# EAGLE design au6850_mp3 (EAGLE 7.6.0)
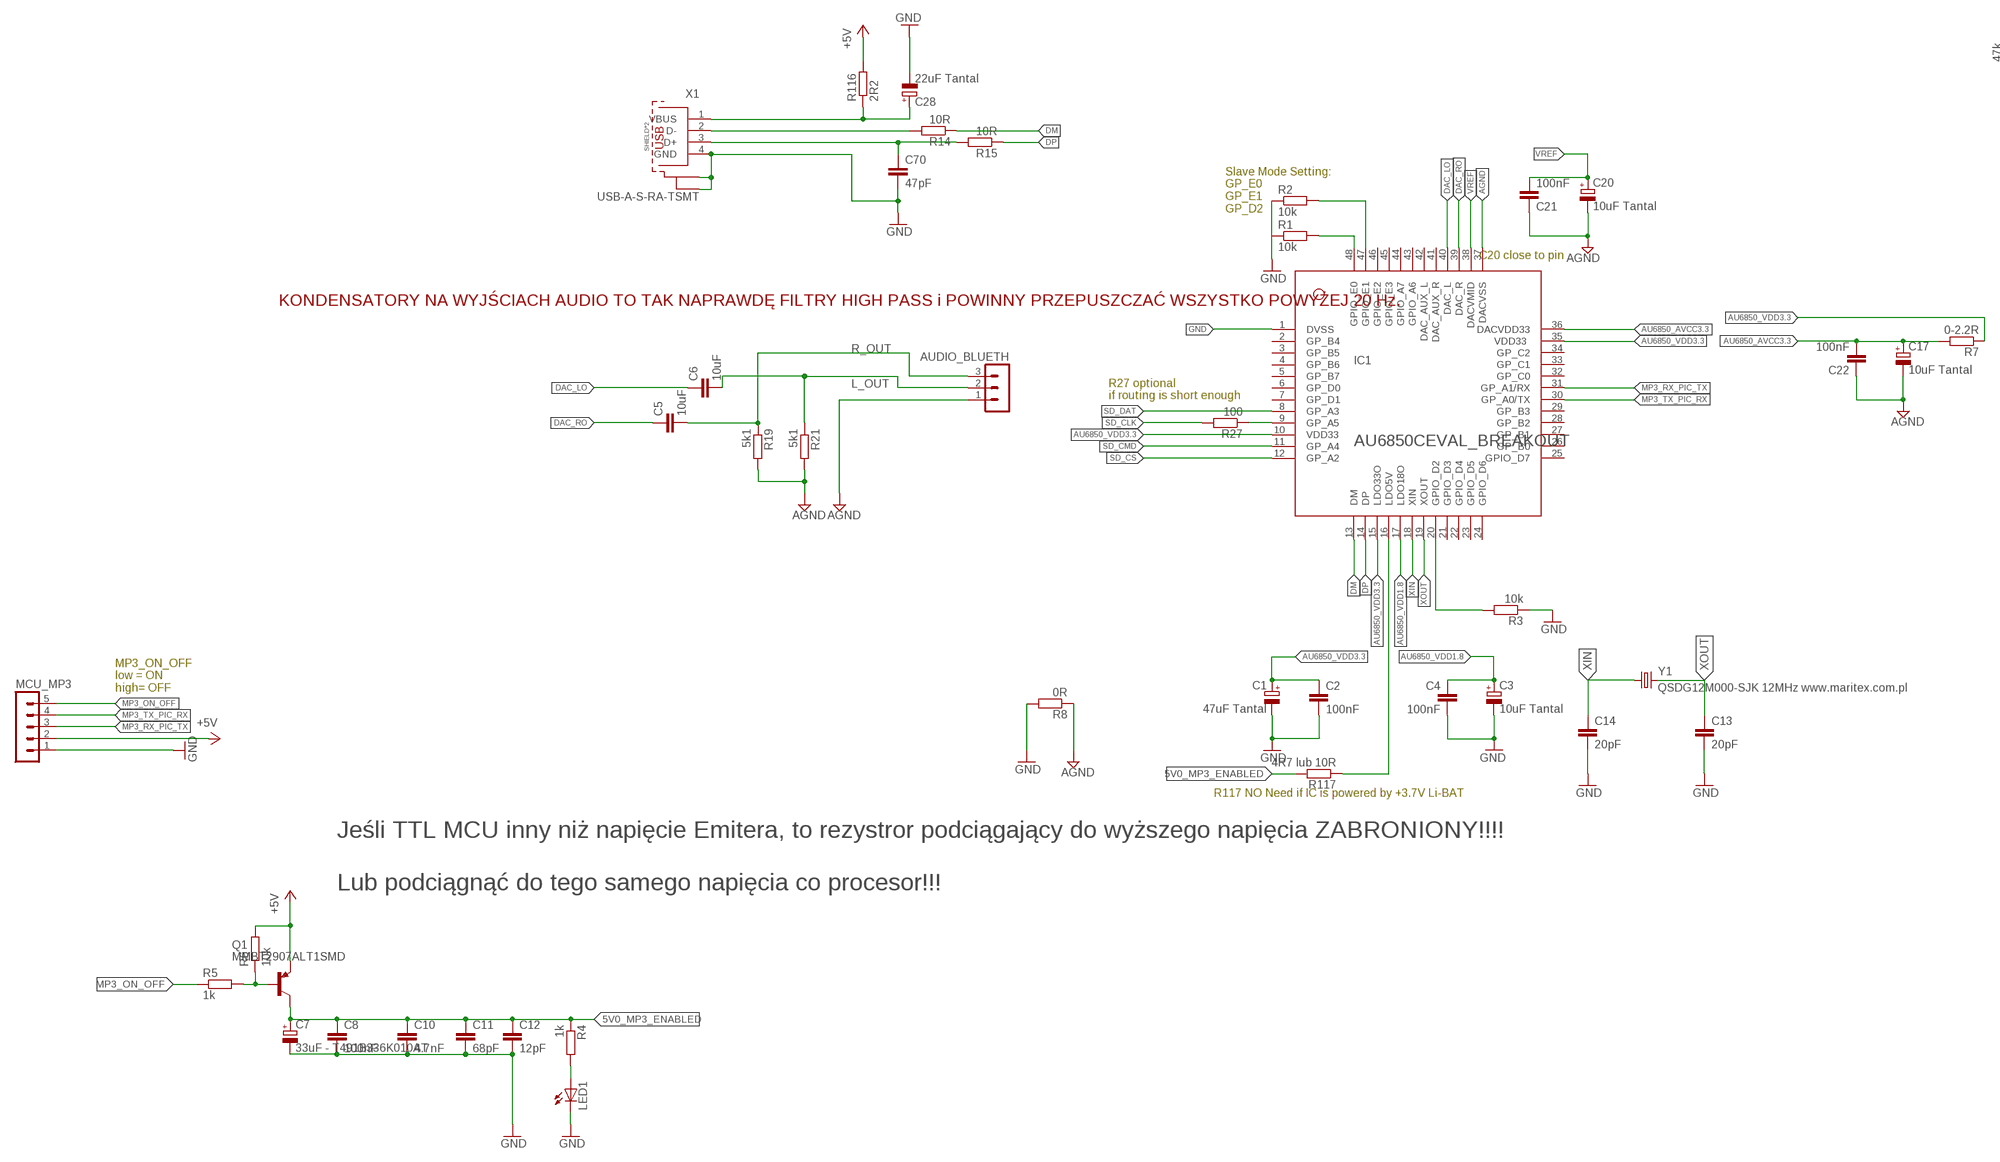
[diagram p0: schematic, sheet 1, part 1 of 2]
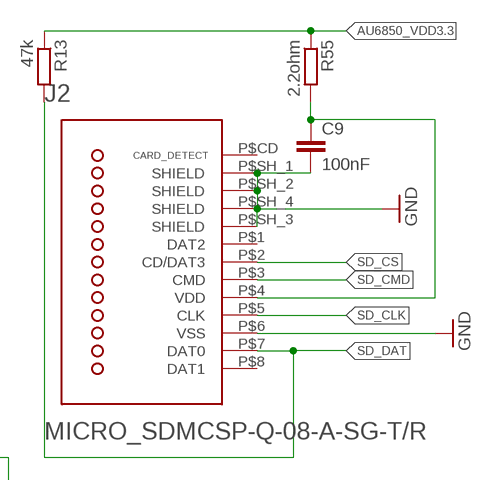
[diagram p1: schematic, sheet 1, part 2 of 2]

## Parts
AUDIO_BLUETH  MA03-1  [MA03-1]
C1  47uF Tantal  CPOL-EUB/3528-21R  [B/3528-21R]
C2  100nF  C-EUC0805  [C0805]
C3  10uF Tantal  CPOL-EUB/3528-21R  [B/3528-21R]
C4  100nF  C-EUC0805  [C0805]
C5  10uF  C-EUC0805  [C0805]
C6  10uF  C-EUC0805  [C0805]
C7  33uF - T491B336K010AT  CPOL-EUSMCB  [SMC_B]
C8  100nF  C-EUC0805  [C0805]
C9  100nF  C-EUC0805  [C0805]
C10  4.7nF  C-EUC0805  [C0805]
C11  68pF  C-EUC0805  [C0805]
C12  12pF  C-EUC0603K  [C0603K]
C13  20pF  C-EUC0805  [C0805]
C14  20pF  C-EUC0805  [C0805]
C17  10uF Tantal  CPOL-EUB/3528-21R  [B/3528-21R]
C20  10uF Tantal  CPOL-EUB/3528-21R  [B/3528-21R]
C21  100nF  C-EUC0805  [C0805]
C22  100nF  C-EUC0805  [C0805]
C28  22uF Tantal  CPOL-EUSMCB  [SMC_B]
C70  47pF  C-EUC0805  [C0805]
IC1  AU6850CEVAL_BREAKOUT  [LQFP48-7BREAKOUT]
J2  MICRO_SDMCSP-Q-08-A-SG-T/R  [MICRO_SD_8PINS]
LED1  LED3MM  [LED3MM]
MCU_MP3  MA05-1  [MA05-1]
Q1  MMBT2907ALT1SMD  [SOT23-BEC]
R1  10k  R-EU_R0805  [R0805]
R2  10k  R-EU_R0805  [R0805]
R3  10k  R-EU_R0805  [R0805]
R4  1k  R-EU_M0805  [M0805]
R5  1k  R-EU_M0805  [M0805]
R6  10k  R-EU_M0805  [M0805]
R7  0-2.2R  R-EU_R0805  [R0805]
R8  0R  R-EU_R0805  [R0805]
R13  47k  R-EU_R0805  [R0805]
R14  10R  R-EU_R0805  [R0805]
R15  10R  R-EU_R0805  [R0805]
R19  5k1  R-EU_R0805  [R0805]
R21  5k1  R-EU_R0805  [R0805]
R27  100  R-EU_R0805  [R0805]
R55  2.2ohm  R-EU_R0805  [R0805]
R116  2R2  R-EU_R0805  [R0805]
R117  4R7 lub 10R  R-EU_R0805  [R0805]
X1  USB-A-S-RA-TSMT  [USB-A-S-RA-TSMT]
Y1  QSDG12M000-SJK 12MHz www.maritex.com.pl  CRYSTALSMD  [HC49UP]

## Nets
5V0_MP3_ENABLED: C7.+ C8.1 C10.1 C11.1 C12.1 Q1.C R4.1 R117.2
+5V: MCU_MP3.2 Q1.E R6.2 R116.2
AGND: AUDIO_BLUETH.1 C17.- C20.- C21.1 C22.1 IC1.37(DACVSS) R8.1 R19.2 R21.2
AU6850_AVCC3.3: C17.+ C22.2 IC1.36(DACVDD33) R7.2
AU6850_VDD1.8: C3.+ C4.1 IC1.17(LDO18O)
AU6850_VDD3.3: C1.+ C2.1 IC1.10(VDD33) IC1.15(LDO33O) IC1.35(VDD33) R7.1 R13.1 R55.1
DAC_LO: C6.1 IC1.40(DAC_L)
DAC_RO: C5.1 IC1.39(DAC_R)
DM: IC1.13(DM) R14.1
DP: IC1.14(DP) R15.1
GND: C1.- C2.2 C3.- C4.2 C7.- C8.2 C9.2 C10.2 C11.2 C12.2 C13.2 C14.2 C28.- C70.2 IC1.1(DVSS) J2.P$6(VSS) J2.P$SH_1(1_GND_PAD) J2.P$SH_2(2_GND_PAD) J2.P$SH_3(3_GND_PAD) J2.P$SH_4(4_GND_PAD) LED1.K(C) MCU_MP3.1 R1.1 R2.1 R3.1 R8.2 X1.4(GND) X1.5(SH1) X1.6(SH2)
L_OUT: AUDIO_BLUETH.2 C6.2 R21.1
MP3_ON_OFF: MCU_MP3.5 R5.1
MP3_RX_PIC_TX: IC1.31(GP_A1/RX) MCU_MP3.3
MP3_TX_PIC_RX: IC1.30(GP_A0/TX) MCU_MP3.4
N$1: LED1.A R4.2
N$2: Q1.B R5.2 R6.1
N$4: IC1.16(LDO5V) R117.1
N$5: IC1.9(GP_A5) R27.1
N$8: C28.+ R116.1 X1.1(VBUS)
N$9: C70.1 R15.2 X1.3(D+)
N$10: R14.2 X1.2(D-)
N$14: C9.1 J2.P$4(VDD) R55.2
R_OUT: AUDIO_BLUETH.3 C5.2 R19.1
SD_CLK: J2.P$5(CLK) R27.2
SD_CMD: IC1.11(GP_A4) J2.P$3(CMD)
SD_CS: IC1.12(GP_A2) J2.P$2(CD/DAT3)
SD_DAT: IC1.8(GP_A3) J2.P$7(DAT0) R13.2
SLAVE_D2: IC1.20(GPIO_D2) R3.2
SLAVE_E0: IC1.48(GPIO_E0) R1.2
SLAVE_E1: IC1.47(GPIO_E1) R2.2
VREF: C20.+ C21.2 IC1.38(DACVMID)
XIN: C14.1 IC1.18(XIN) Y1.1
XOUT: C13.1 IC1.19(XOUT) Y1.2
Unconnected: IC1.2(GP_B4) IC1.3(GP_B5) IC1.4(GP_B6) IC1.5(GP_B7) IC1.6(GP_D0) IC1.7(GP_D1) IC1.21(GPIO_D3) IC1.22(GPIO_D4) IC1.23(GPIO_D5) IC1.24(GPIO_D6) IC1.25(GPIO_D7) IC1.26(GP_B0) IC1.27(GP_B1) IC1.28(GP_B2) IC1.29(GP_B3) IC1.32(GP_C0) IC1.33(GP_C1) IC1.34(GP_C2) IC1.41(DAC_AUX_R) IC1.42(DAC_AUX_L) IC1.43(GPIO_A6) IC1.44(GPIO_A7) IC1.45(GPIO_E3) IC1.46(GPIO_E2) J2.P$1(DAT2) J2.P$8(DAT1) J2.P$CD(CARD_DETECT_SW)

## Notes on the sheet
- Slave Mode Setting:
  GP_E0
  GP_E1
  GP_D2
- C20 close to pin
- KONDENSATORY NA WYJŚCIACH AUDIO TO TAK NAPRAWDĘ FILTRY HIGH PASS i POWINNY PRZEPUSZCZAĆ WSZYSTKO POWYŻEJ 20 Hz.
- R27 optional
  if routing is short enough
- MP3_ON_OFF
  low = ON
  high= OFF
- R117 NO Need if IC is powered by +3.7V Li-BAT
- Jeśli TTL MCU inny niż napięcie Emitera, to rezystror podciągający do wyższego napięcia ZABRONIONY!!!!
  
  Lub podciągnąć do tego samego napięcia co procesor!!!

## Library data of the parts
AUDIO_BLUETH = con-lstb:MA03-1: PIN HEADER; OC_FARNELL: unknown; OC_NEWARK: unknown
C1 = rcl:CPOL-EU: POLARIZED CAPACITOR, European symbol; PARTNUM: TAJB476K010R; SUPPLIER: TME
C2 C4-C6 C21 C22 = rcl:C-EU: CAPACITOR, European symbol
C3 = rcl:CPOL-EU: POLARIZED CAPACITOR, European symbol; PARTNUM: TAJA106K010R; SUPPLIER: TME
C7 = resistor:CPOL-EU: POLARIZED CAPACITOR, European symbol; PARTNUM: TAJB336K010R; SUPPLIER: TME
C8-C14 C70 = resistor:C-EU: CAPACITOR, European symbol
C17 C20 = rcl:CPOL-EU: POLARIZED CAPACITOR, European symbol
C28 = rcl:CPOL-EU: POLARIZED CAPACITOR, European symbol; PARTNUM: TAJB226M010R; SUPPLIER: TME
IC1 = mvsilicon:AU6850C
J2 = ADAM_TECH_SD_Card:MICRO_SD: Adam Tech; PARTNUM: MCSP-Q-08-A-SG-T/R; SUPPLIER: TME
LED1 = led:LED: LED OSRAM: - CHIPLED LG R971, LG N971, LY N971, LG Q971, LY Q971, LO R971, LY R971 LH N974, LH R974 LS Q976, LO Q976, LY Q976 LO Q996 - Hyper CHIPLED LW Q18S LB Q993, LB Q99A, LB R99A - SideLED LS A670, LO A670, LY A670, LG A670, LP A670 LB A673, LV A673, LT A673, LW A673 LH A674 LY A675 LS A676, LA A676, LO A676, LY A676, LW A676 LS A679, LY A679, LG A679 - Hyper Micro SIDELED® LS Y876, LA Y876, LO Y876, LY Y876 LT Y87S - SmartLED LW L88C, LW L88S LB L89C, LB L89S, LG L890 LS L89K, LO L89K, LY L89K LS L896, LA L896, LO L896, LY L896 - TOPLED LS T670, LO T670, LY T670, LG T670, LP T670 LSG T670, LSP T670, LSY T670, LOP T670, LYG T670 LG T671, LOG T671, LSG T671 LB T673, LV T673, LT T673, LW T673 LH T674 LS T676, LA T676, LO T676, LY T676, LB T676, LH T676, LSB T676, LW T676 LB T67C, LV T67C, LT T67C, LS T67K, LO T67K, LY T67K, LW E67C LS E67B, LA E67B, LO E67B, LY E67B, LB E67C, LV E67C, LT E67C LW T67C LS T679, LY T679, LG T679 LS T770, LO T770, LY T770, LG T770, LP T770 LB T773, LV T773, LT T773, LW T773 LH T774 LS E675, LA E675, LY E675, LS T675 LS T776, LA T776, LO T776, LY T776, LB T776 LHGB T686 LT T68C, LB T68C - Hyper Mini TOPLED® LB M676 - Mini TOPLED Santana® LG M470 LS M47K, LO M47K, LY M47K Source: http://www.osram.convergy.de LUXEON: - LUMILED® LXK2-PW12-R00, LXK2-PW12-S00, LXK2-PW14-U00, LXK2-PW14-V00 LXK2-PM12-R00, LXK2-PM12-S00, LXK2-PM14-U00 LXK2-PE12-Q00, LXK2-PE12-R00, LXK2-PE12-S00, LXK2-PE14-T00, LXK2-PE14-U00 LXK2-PB12-K00, LXK2-PB12-L00, LXK2-PB12-M00, LXK2-PB14-N00, LXK2-PB14-P00, LXK2-PB14-Q00 LXK2-PR12-L00, LXK2-PR12-M00, LXK2-PR14-Q00, LXK2-PR14-R00 LXK2-PD12-Q00, LXK2-PD12-R00, LXK2-PD12-S00 LXK2-PH12-R00, LXK2-PH12-S00 LXK2-PL12-P00, LXK2-PL12-Q00, LXK2-PL12-R00 Source: www.luxeon.com KINGBRIGHT: KA-3528ASYC Source: www.kingbright.com
MCU_MP3 = con-lstb:MA05-1: PIN HEADER; OC_FARNELL: unknown; OC_NEWARK: unknown
Q1 = transistor-pnp:MMBT2907*: PNP Transistror
R1-R8 R13-R15 R19 R21 R27 R55 R116 R117 = rcl:R-EU_: RESISTOR, European symbol
X1 = ADAM_TECH_USB-A-S-RA-TSMT:USB-A-S-RA-TSMT: MULTICOMP - USB-A-S-RA-TSMT - USB, 3.0 TYPE A, RECEPTACLE, SMT CUI -UJ2-AH-1-SMT-TR, 3.0 TYPE A, RECEPTACLE, SMT AdamTech - USB-A-S-RA-TSMT - USB, 3.0 TYPE A, RECEPTACLE, SMT Source: Datasheet <http://www.farnell.com/datasheets/1864222.pdf>; DESCRIPTION: MULTICOMP - USB-A-S-RA-TSMT - USB, 3.0 TYPE A, RECEPTACLE, SMT; HEIGHT: mm; MANUFACTURER_NAME: MULTICOMP; MANUFACTURER_PART_NUMBER: USB-A-S-RA-TSMT
Y1 = SparkFun-FreqCtrl:CRYSTAL: Various standard crystals. Proven footprints. Spark Fun Electronics SKU : COM-00534; PARTNUM: 12.00M-SMDHC49S; SUPPLIER: TME

## Board
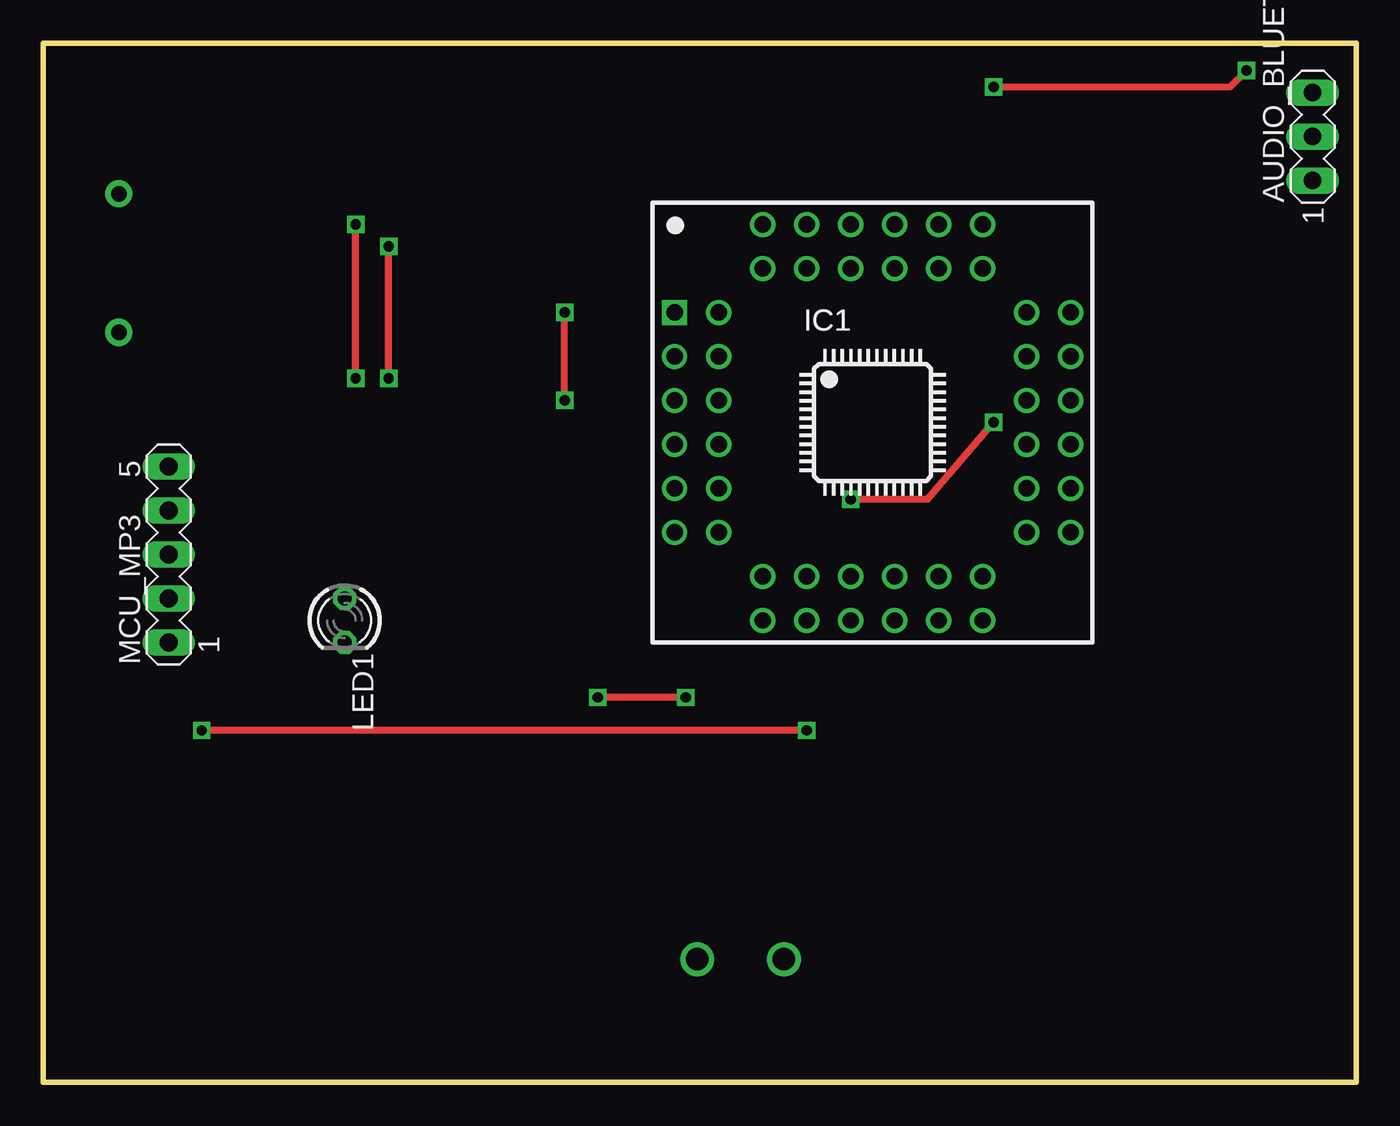
[diagram p2: board, top side]
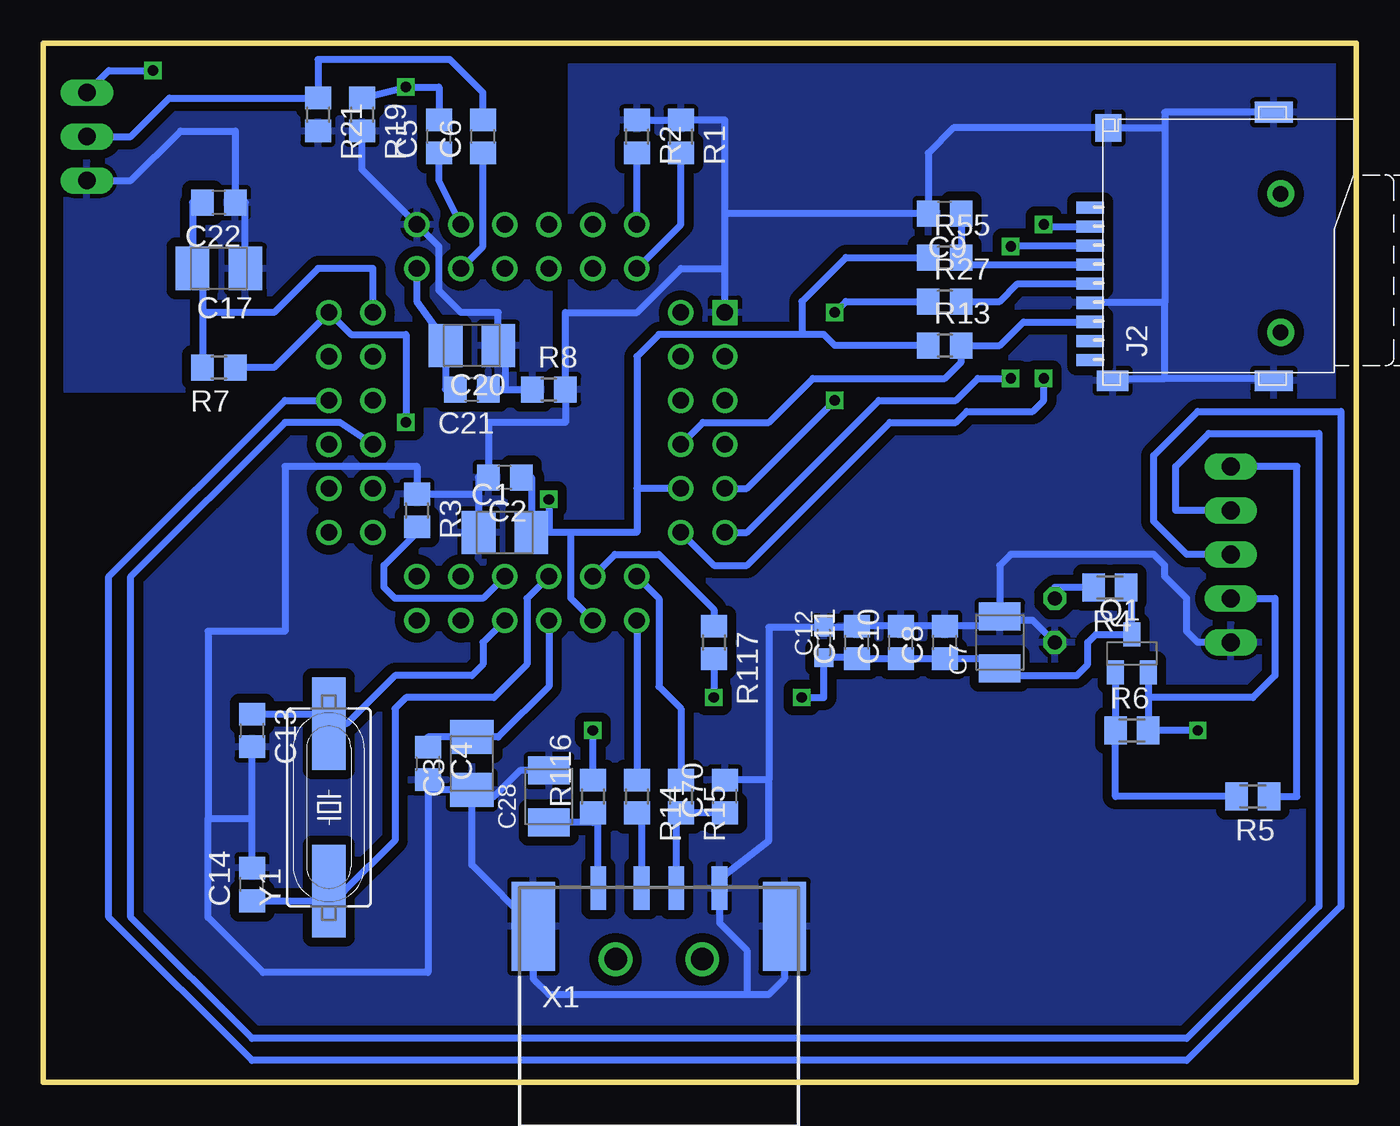
[diagram p3: board, bottom side, seen from below]

Size 75.8 x 59.99 mm. Coordinates in mm from the lower left corner, seen from the top.
Outline: 0,0 75.8,0 75.8,59.99 0,59.99 0,0
Copper layers (1*16): Top 0.035mm / dielectric 1.5mm / Bottom 0.035mm
Design rules "default": minimum track width 10mil, minimum drill 24mil, track to track 8mil, track to pad 8mil, pad to pad 8mil, via to via 8mil, smd to smd 8mil, copper to edge 40mil, drill to drill 8mil, minimum pad ring 10mil, minimum via ring 8mil, stop-mask expansion 4mil, vias tented up to drill 0mil, thermal gap 10mil

### Footprints (pad centres in the part's own frame; a part is rotated, then mirrored left to right if it is on the bottom)
MA03-1 = drill 1.016 long: 1 -2.54,0; 2 0,0; 3 2.54,0
B/3528-21R = smd 1.95 x 2.5: + 1.525,0; - -1.525,0
C0805 = smd 1.3 x 1.5: 1 -0.95,0; 2 0.95,0
SMC_B = smd 1.6 x 2.4: + -1.5,0; - 1.5,0
C0603K = smd 1.05 x 1.08: 1 -0.875,0; 2 0.875,0
LQFP48-7BREAKOUT = drill 0.95 square: 1 -11.43,6.35 | drill 0.95: 2 -8.89,6.35; 3 -11.43,3.81; 4 -8.89,3.81; 5 -11.43,1.27; 6 -8.89,1.27; 7 -11.43,-1.27; 8 -8.89,-1.27; 9 -11.43,-3.81; 10 -8.89,-3.81; 11 -11.43,-6.35; 12 -8.89,-6.35; 13 -6.35,-11.43; 14 -6.35,-8.89; 15 -3.81,-11.43; 16 -3.81,-8.89; 17 -1.27,-11.43; 18 -1.27,-8.89; 19 1.27,-11.43; 20 1.27,-8.89; 21 3.81,-11.43; 22 3.81,-8.89; 23 6.35,-11.43; 24 6.35,-8.89; 25 11.43,-6.35; 26 8.89,-6.35; 27 11.43,-3.81; 28 8.89,-3.81; 29 11.43,-1.27; 30 8.89,-1.27; 31 11.43,1.27; 32 8.89,1.27; 33 11.43,3.81; 34 8.89,3.81; 35 11.43,6.35; 36 8.89,6.35; 37 6.35,11.43; 38 6.35,8.89; 39 3.81,11.43; 40 3.81,8.89; 41 1.27,11.43; 42 1.27,8.89; 43 -1.27,11.43; 44 -1.27,8.89; 45 -3.81,11.43; 46 -3.81,8.89; 47 -6.35,11.43; 48 -6.35,8.89
MICRO_SD_8PINS = drill 0.9 pad 1.575: 1 -4.95,-10.5; 15 3.05,-10.5 | smd 0.7 x 1.6: P$1 2.25,0.5; P$2 1.15,0.5; P$3 0.05,0.5; P$4 -1.05,0.5; P$5 -2.15,0.5; P$6 -3.25,0.5; P$7 -4.35,0.5; P$8 -5.45,0.5; P$CD -6.55,0.5 | smd 1.2 x 2.2: P$SH_1 -7.75,-10.1; P$SH_2 7.75,-10.1 | smd 1.2 x 1.8: P$SH_3 -7.75,-0.8 | smd 1.6 x 1.5: P$SH_4 6.85,-0.55
LED3MM = drill 0.813 octagon: A -1.27,0; K 1.27,0
MA05-1 = drill 1.016 long: 1 -5.08,0; 2 -2.54,0; 3 0,0; 4 2.54,0; 5 5.08,0
SOT23-BEC = smd 1 x 1.4: B -0.95,-1.1; C 0,1.1; E 0.95,-1.1
R0805 = smd 1.3 x 1.5: 1 -0.95,0; 2 0.95,0
M0805 = smd 1.3 x 1.6: 1 -0.95,0; 2 0.95,0
USB-A-S-RA-TSMT = smd 0.9 x 2.5: 1 -3.5,13.75; 2 -1,13.75; 3 1,13.75; 4 3.5,13.75 | smd 2.5 x 5.15: 5 -7.25,11.55; 6 7.25,11.55 | drill 1.3 pad 1.95: 7 -2.5,9.65; 8 2.5,9.65
HC49UP = smd 5.334 x 1.93: 1 -4.826,0; 2 4.826,0

### Placement (x,y rotation side)
AUDIO_BLUETH  73.28,54.61 90 top
C1  49.15,31.75 0 bottom
C2  49.15,34.93 180 bottom
C3  51.05,18.41 90 bottom
C4  53.59,18.41 270 bottom
C5  52.96,54.61 90 bottom
C6  50.42,54.61 90 bottom
C7  20.57,25.4 90 bottom
C8  23.75,25.4 90 bottom
C9  23.75,50.16 180 bottom
C10  26.29,25.4 90 bottom
C11  28.83,25.4 90 bottom
C12  30.73,25.4 90 bottom
C13  63.75,20.32 270 bottom
C14  63.75,11.43 90 bottom
C17  65.66,46.99 180 bottom
C20  51.05,42.55 180 bottom
C21  51.05,40.01 180 bottom
C22  65.66,50.8 180 bottom
C28  46.61,16.51 90 bottom
C70  36.45,16.51 90 bottom
IC1  47.88,38.1 0 top
J2  14.86,48.26 90 bottom
LED1  17.4,26.67 270 top
MCU_MP3  7.24,30.48 90 top
Q1  12.95,24.77 0 bottom
R1  38.99,54.61 270 bottom
R2  41.53,54.61 270 bottom
R3  54.23,33.02 270 bottom
R4  14.22,28.57 180 bottom
R5  5.97,16.51 180 bottom
R6  12.95,20.32 0 bottom
R7  65.66,41.27 180 bottom
R8  46.61,40.01 0 bottom
R13  23.75,42.55 0 bottom
R14  41.53,16.51 270 bottom
R15  38.99,16.51 270 bottom
R19  57.4,55.88 270 bottom
R21  59.94,55.88 270 bottom
R27  23.75,45.09 0 bottom
R55  23.75,47.62 0 bottom
R116  44.07,16.51 90 bottom
R117  37.08,25.4 270 bottom
X1  40.26,-2.54 0 bottom
Y1  59.31,15.88 90 bottom

### Tracks (layer width: path | path; a pad name or v marks a point on that pad's centre or on a via)
5V0_MP3_ENABLED  (via drill 0.6)
  Top 0.406: v37.08,22.23 v32,22.23
  Bottom 0.406: R4.1 arc90 12.95,28.26 Q1.C 15.03,25.87 15.49,25.4 15.49,24.13 16.13,23.5 20.17,23.5 C7.+ 21.12,24.45 C8.1 C10.1 C11.1 28.9,24.53 C12.1 30.73,22.23 v32,22.23 | R117.2 v37.08,22.23
+5V  (via drill 0.6)
  Top 0.406: v44.07,20.32 v9.14,20.32
  Bottom 0.406: Q1.E 12,22.23 | 12,22.23 R6.2 v9.14,20.32 | MCU_MP3.2 4.7,27.94 4.7,23.5 5.97,22.23 12,22.23 | R116.2 v44.07,20.32
AGND
  Bottom 0.406: AUDIO_BLUETH.1 70.74,52.07 67.88,54.93 64.71,54.93 C22.1 | C22.1 64.39,50.8 | C17.- 64.13,50.8 C22.1 | C21.1 49.15,40.01 | 49.15,40.01 R8.1 | 49.15,40.01 49.15,42.16 C20.- 49.53,44.45 51.69,44.45 52.96,45.72 52.96,48.26 IC1.37 57.4,52.7 R19.2
  pour Bottom (isolate 0.533): 46.61,40.01 79.63,40.01 79.63,62.23 46.61,62.23
AU6850_AVCC3.3
  Bottom 0.406: C22.2 67.18,50.8 C17.+ 66.61,46.99 66.61,44.45 | 66.61,44.45 R7.2 | IC1.36 56.77,46.99 59.94,46.99 62.48,44.45 66.61,44.45
AU6850_VDD1.8
  Bottom 0.406: IC1.17 46.61,22.86 49.53,19.94 C3.+ 53.59,19.94 C4.1
AU6850_VDD3.3  (via drill 0.6)
  Top 0.406: v54.86,38.1 51.05,33.66 v46.61,33.66
  Bottom 0.406: IC1.15 45.34,27.94 45.34,31.75 | IC1.10 41.53,34.29 | R7.1 62.48,41.27 IC1.35 58.04,43.18 54.86,43.18 v54.86,38.1 | R13.1 30.1,42.55 30.73,43.18 32,43.18 | 32,43.18 40.26,43.18 41.53,41.91 41.53,34.29 | 32,43.18 32,45.09 29.46,47.62 R55.1 | 41.53,34.29 41.53,31.75 45.34,31.75 | 45.34,31.75 46.61,31.75 | 46.61,31.75 C1.+ 47.62,34.93 C2.1 | v46.61,33.66 46.61,31.75
DAC_LO
  Bottom 0.406: IC1.40 50.42,48.26 C6.1
DAC_RO
  Bottom 0.406: IC1.39 52.96,52.07 C5.1
DM
  Bottom 0.406: IC1.13 R14.1
DP
  Bottom 0.406: IC1.14 40.26,27.94 40.26,22.86 38.99,21.59 R15.1
GND
  Bottom 0.406: R2.1 R1.1 36.45,55.56 36.45,50.16 | C28.- 48.28,18.01 49.78,16.51 50.67,16.51 C3.- | 35.18,5.08 46.61,5.08 47.51,5.98 X1.5 51.05,12.55 C3.- | 35.18,5.08 33.91,5.08 33.01,5.98 X1.6 | 35.18,5.08 35.18,7.62 36.76,9.2 X1.4 36.76,11.75 33.91,13.97 33.91,17.46 | C3.- 53.59,16.89 | 53.59,16.89 C4.2 | 53.59,16.89 53.59,6.35 63.12,6.35 66.29,9.52 66.29,15.24 | 33.91,17.46 C70.2 | IC1.1 36.45,46.99 | 36.45,46.99 36.45,50.16 | 36.45,46.99 38.99,46.99 41.53,44.45 45.66,44.45 R8.2 45.66,38.1 50.1,38.1 C2.2 50.67,34.93 C1.- 50.67,33.97 R3.1 | C7.- 21.12,26.35 C8.2 C10.2 C11.2 28.9,26.28 C12.2 33.91,26.28 33.91,17.46 | LED1.K 18.67,26.67 19.94,26.67 20.17,26.9 C7.- | 36.45,50.16 C9.2 24.7,53.66 23.25,55.11 J2.P$SH_4 11.05,55.11 | J2.P$SH_3 13.93,40.64 11.05,40.64 | 11.05,40.64 11.05,45.01 | 11.05,45.01 J2.P$6 | J2.P$SH_1 4.76,40.64 11.05,40.64 | J2.P$SH_2 11.05,56.01 11.05,55.11 | 11.05,55.11 11.05,45.01 | C14.2 63.75,15.24 | 63.75,15.24 C13.2 | 66.29,15.24 63.75,15.24 | R3.1 54.54,33.97 | 66.29,15.24 66.29,26.04 61.85,26.04 61.85,35.56 54.23,35.56 R3.1 | MCU_MP3.1 9.14,25.4 9.78,26.04 9.78,27.94 11.05,29.21 11.05,29.84 11.68,30.48 19.94,30.48 20.57,29.84 C7.-
  pour Bottom (isolate 0.533): -1.65,-2.54 -2.92,-2.54 -2.92,62.23 45.34,62.23 45.34,38.73 79.63,38.73 79.63,-6.35 -1.65,-6.35
L_OUT
  Bottom 0.406: AUDIO_BLUETH.2 70.74,54.61 68.52,56.83 R21.1 59.94,59.05 52.32,59.05 50.42,57.15 C6.2
MP3_ON_OFF
  Bottom 0.406: R5.1 3.43,16.51 3.43,35.56 MCU_MP3.5
MP3_RX_PIC_TX
  Bottom 0.406: MCU_MP3.3 9.78,30.48 11.68,32.38 11.68,36.2 9.14,38.73 0.89,38.73 0.89,10.16 9.78,1.27 63.75,1.27 72.01,9.52 72.01,29.21 61.85,39.37 IC1.31
MP3_TX_PIC_RX
  Bottom 0.406: MCU_MP3.4 10.41,33.02 10.41,35.56 8.51,37.47 2.16,37.47 2.16,10.16 9.78,2.54 63.75,2.54 70.74,9.52 70.74,29.21 61.85,38.1 58.67,38.1 IC1.30
N$1
  Bottom 0.406: R4.2 17.4,28.57 LED1.A
N$2
  Bottom 0.406: R5.2 13.9,16.51 R6.1 Q1.B
N$4
  Bottom 0.406: IC1.16 42.8,30.48 40.26,30.48 37.08,27.3 R117.1
N$5  (via drill 0.6)
  Top 0.406: v30.1,39.37 v30.1,44.45
  Bottom 0.406: IC1.9 35.18,34.29 v30.1,39.37 | v30.1,44.45 29.46,45.09 R27.1
N$8
  Bottom 0.406: C28.+ 44.07,15.01 R116.1 43.76,15.56 X1.1
N$9
  Bottom 0.406: X1.3 39.26,15.29 arc90 R15.2 C70.1
N$10
  Bottom 0.406: R14.2 arc90 41.26,15.29 X1.2
N$14
  Bottom 0.406: C9.1 R55.2 22.8,47.21 J2.P$4
R_OUT  (via drill 0.6)
  Top 0.406: v69.47,58.42 68.51,57.47 v54.86,57.47
  Bottom 0.406: AUDIO_BLUETH.3 72.01,58.42 v69.47,58.42 | C5.2 52.96,57.47 v54.86,57.47 R19.1
SD_CLK
  Bottom 0.406: R27.2 20.57,45.09 19.55,46.11 J2.P$5
SD_CMD  (via drill 0.6)
  Top 0.406: v19.94,40.64 v19.94,48.26
  Bottom 0.406: IC1.11 35.18,31.75 27.56,39.37 23.11,39.37 21.84,40.64 v19.94,40.64 | v19.94,48.26 19.89,48.31 J2.P$3
SD_CS  (via drill 0.6)
  Top 0.406: v18.03,40.64 v18.03,49.53
  Bottom 0.406: IC1.12 37.08,29.84 35.18,29.84 26.92,38.1 23.11,38.1 22.48,38.73 18.67,38.73 18.03,39.37 v18.03,40.64 | v18.03,49.53 17.91,49.41 J2.P$2
SD_DAT
  Bottom 0.406: J2.P$7 19.21,43.91 20.57,42.55 R13.2 22.8,41.59 23.75,40.64 31.37,40.64 33.91,38.1 37.72,38.1 IC1.8
SLAVE_D2
  Bottom 0.406: IC1.20 50.42,27.94 55.5,27.94 56.13,28.57 56.13,29.84 54.23,31.75 R3.2
SLAVE_E0
  Bottom 0.406: IC1.48 38.99,49.53 R1.2
SLAVE_E1
  Bottom 0.406: IC1.47 R2.2
VREF
  Bottom 0.406: IC1.38 54.23,45.09 52.58,42.8 C20.+ 52.58,40.01 C21.2
XIN
  Bottom 0.406: IC1.18 47.88,27.94 47.88,24.13 49.78,22.23 54.86,22.23 55.5,21.59 55.5,13.97 58.42,11.05 Y1.1 59.31,10.48 C14.1
XOUT
  Bottom 0.406: IC1.19 50.42,25.4 50.42,24.13 51.05,23.5 55.5,23.5 58.29,20.7 Y1.2 59.31,21.27 C13.1